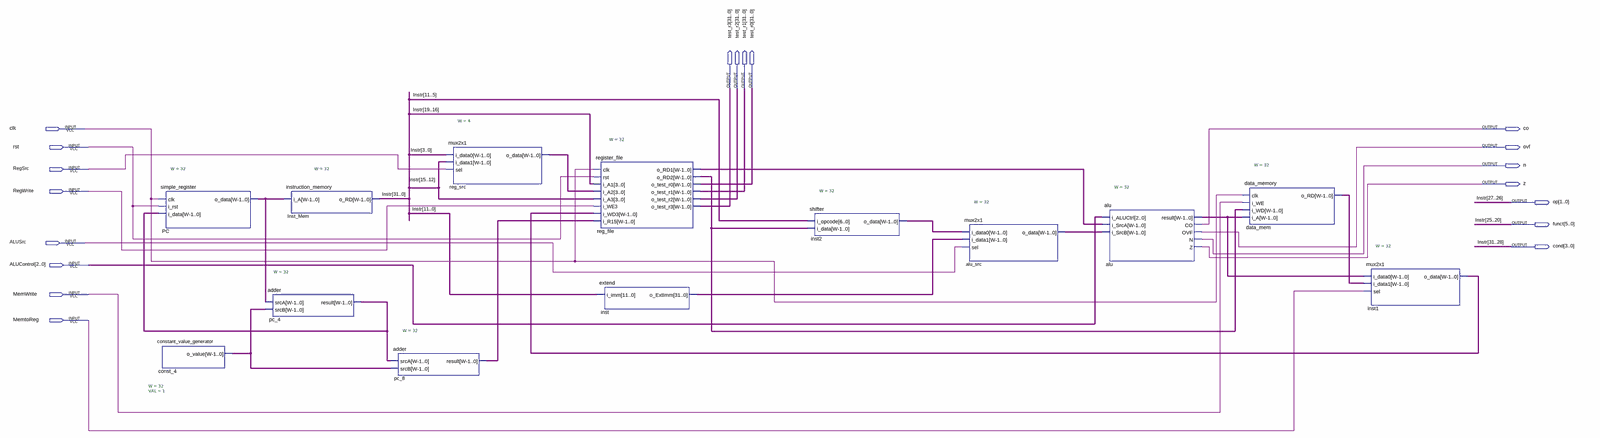
[diagram p0: schematic sheet, whole]
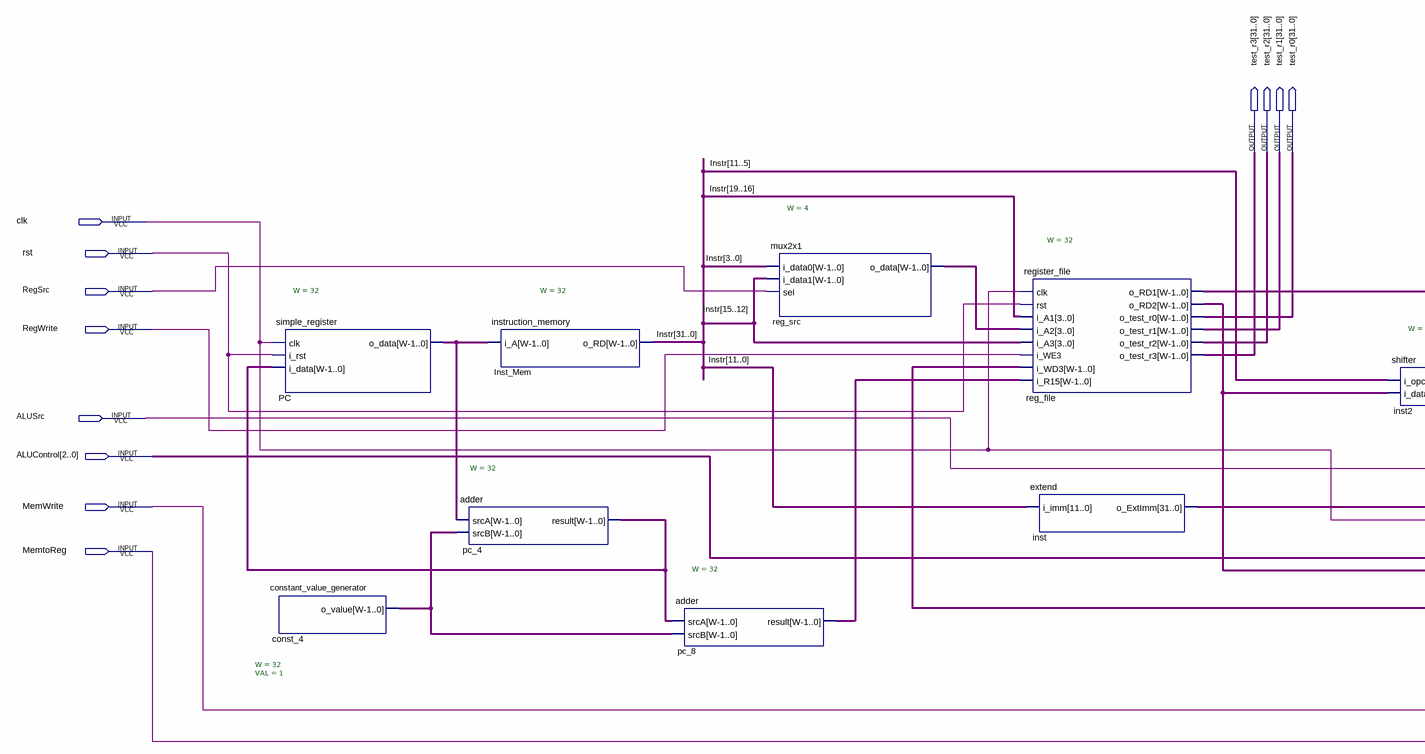
[diagram p1: schematic sheet, left part]
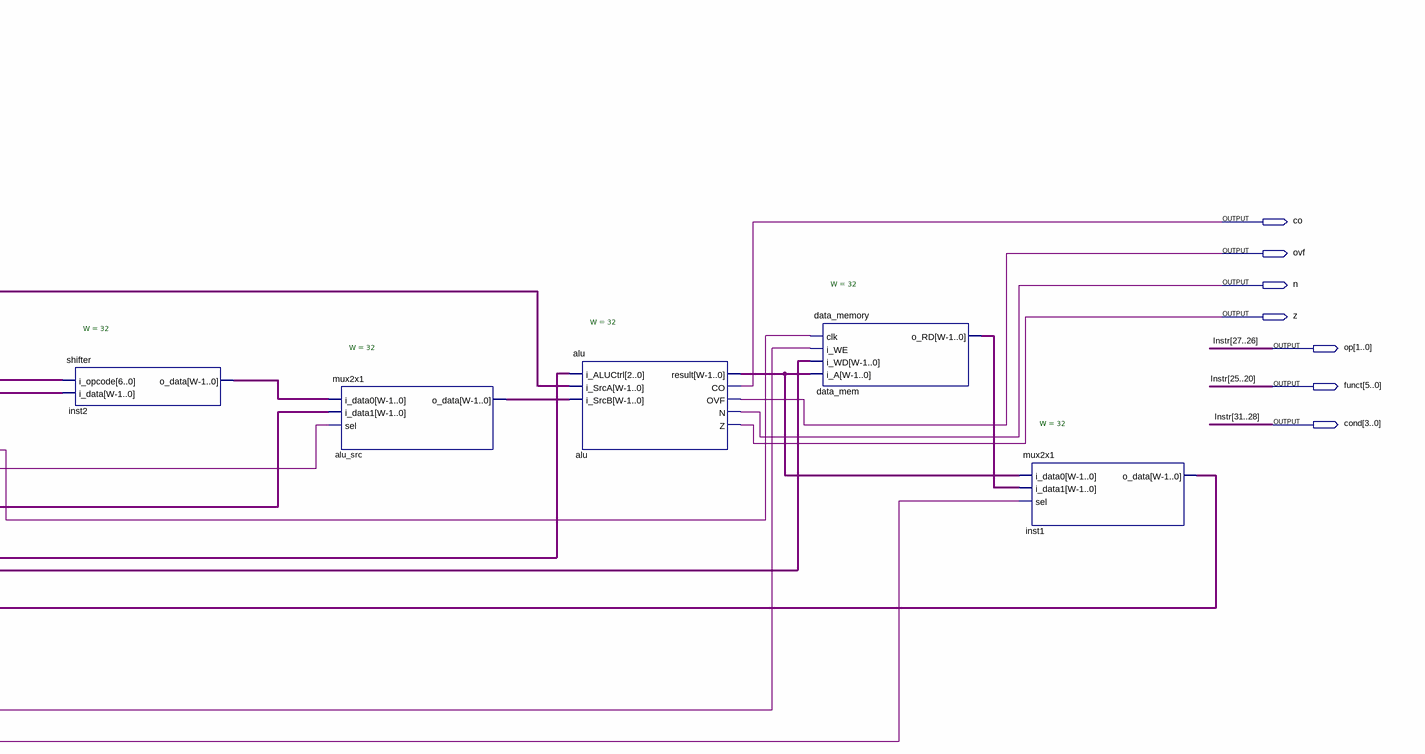
[diagram p2: schematic sheet, right part]
// Quartus schematic datapath.bdf as structural Verilog: 13 symbols, 19 pins
module datapath (
  input  clk,
  input  rst,
  input  RegSrc,
  input  RegWrite,
  input  ALUSrc,
  input  [2:0] ALUControl,
  input  MemWrite,
  input  MemtoReg,
  output [31:0] test_r3,
  output [31:0] test_r2,
  output [31:0] test_r1,
  output [31:0] test_r0,
  output co,
  output ovf,
  output n,
  output z,
  output [1:0] op,
  output [5:0] funct,
  output [3:0] cond
);

  wire [3:0] reg_src_o_data;
  wire [19:0] Instr;
  wire [31:0] alu_result, alu_src_o_data, const_4_o_value, data_mem_o_rd, inst1_o_data, inst2_o_data,
       inst_o_extimm, pc_4_result, pc_8_result, PC_o_data, reg_file_o_rd1, reg_file_o_rd2;

  simple_register #(.W(32)) PC (.clk(clk), .i_rst(rst), .i_data(pc_4_result), .o_data(PC_o_data));
  constant_value_generator #(.W(32), .VAL(1)) const_4 (.o_value(const_4_o_value));
  adder #(.W(32)) pc_4 (.srcA(PC_o_data), .srcB(const_4_o_value), .result(pc_4_result));
  instruction_memory #(.W(32)) Inst_Mem (.i_A(PC_o_data), .o_RD({cond, op, funct, Instr}));
  adder #(.W(32)) pc_8 (.srcA(pc_4_result), .srcB(const_4_o_value), .result(pc_8_result));
  mux2x1 #(.W(4)) reg_src (.i_data0(Instr[3:0]), .i_data1(Instr[15:12]), .sel(RegSrc), .o_data(reg_src_o_data));
  register_file #(.W(32)) reg_file (
    .clk(clk), .rst(rst), .i_A1(Instr[19:16]), .i_A2(reg_src_o_data), .i_A3(Instr[15:12]), .i_WE3(RegWrite),
    .i_WD3(inst1_o_data), .i_R15(pc_8_result), .o_RD1(reg_file_o_rd1), .o_RD2(reg_file_o_rd2),
    .o_test_r0(test_r0), .o_test_r1(test_r1), .o_test_r2(test_r2), .o_test_r3(test_r3));
  extend inst (.i_imm(Instr[11:0]), .o_ExtImm(inst_o_extimm));
  shifter #(.W(32)) inst2 (.i_opcode(Instr[11:5]), .i_data(reg_file_o_rd2), .o_data(inst2_o_data));
  mux2x1 #(.W(32)) alu_src (.i_data0(inst2_o_data), .i_data1(inst_o_extimm), .sel(ALUSrc), .o_data(alu_src_o_data));
  alu #(.W(32)) alu (
    .i_ALUCtrl(ALUControl), .i_SrcA(reg_file_o_rd1), .i_SrcB(alu_src_o_data), .result(alu_result), .CO(co),
    .OVF(ovf), .N(n), .Z(z));
  data_memory #(.W(32)) data_mem (
    .clk(clk), .i_WE(MemWrite), .i_WD(reg_file_o_rd2), .i_A(alu_result), .o_RD(data_mem_o_rd));
  mux2x1 #(.W(32)) inst1 (.i_data0(alu_result), .i_data1(data_mem_o_rd), .sel(MemtoReg), .o_data(inst1_o_data));

  // Other names for the same wires on the sheet: Instr[31:20] = {cond, op, funct}
endmodule
